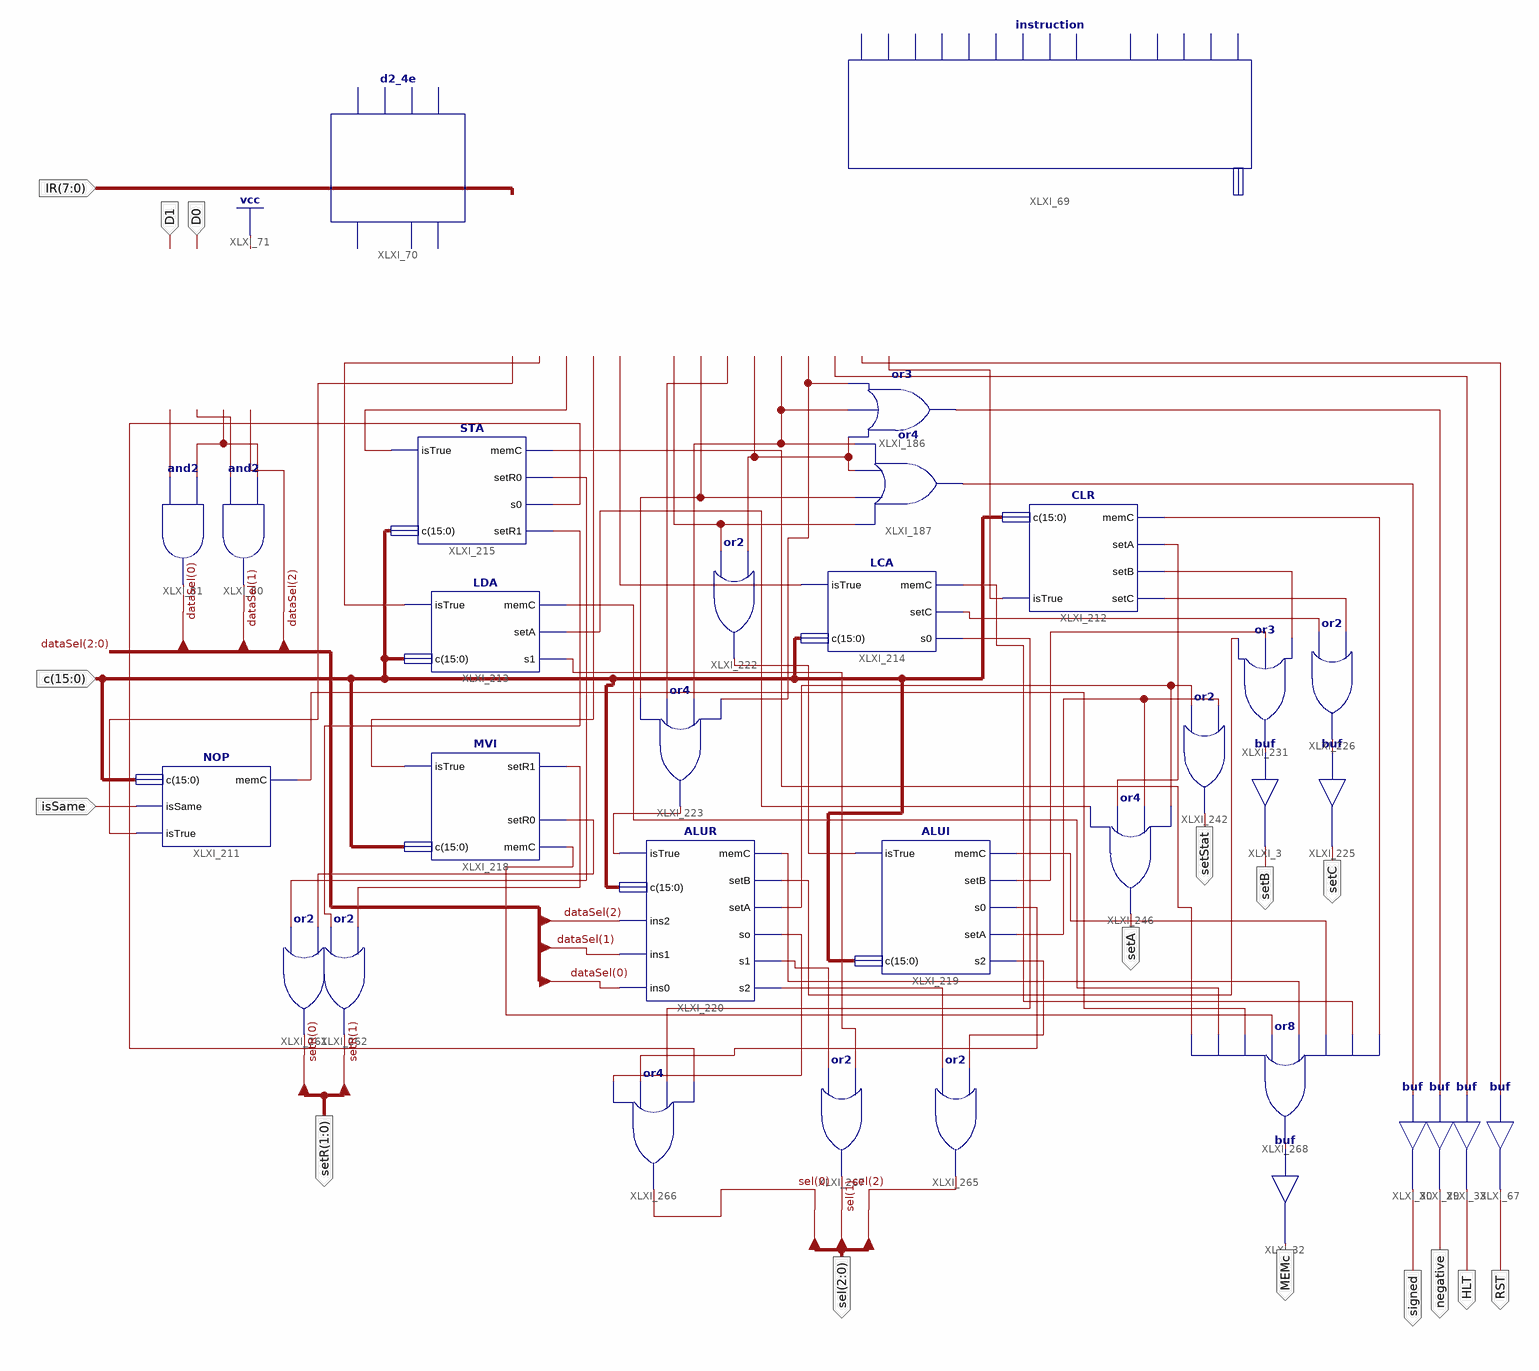
[diagram p0: schematic sheet 1]
// Xilinx ISE schematic signals.sch (spartan3e) as structural Verilog: 33 symbols, 16 ports
module signals (
  input  [7:0] IR,
  input  D0,
  input  D1,
  input  isSame,
  input  [15:0] c,
  output RST,
  output HLT,
  output negative,
  output \signed ,
  output setC,
  output setB,
  output setStat,
  output setA,
  output [2:0] sel,
  output [1:0] setR,
  output MEMc
);

  wire XLXN_142, XLXN_144, XLXN_145, XLXN_273, XLXN_274, XLXN_293, XLXN_306, XLXN_307, XLXN_314, XLXN_318,
       XLXN_340, XLXN_348, XLXN_349, XLXN_350, XLXN_351, XLXN_352, XLXN_355, XLXN_359, XLXN_360, XLXN_393,
       XLXN_395, XLXN_408, XLXN_411, XLXN_415, XLXN_420, XLXN_424, XLXN_425, XLXN_441, XLXN_445, XLXN_446,
       XLXN_460, XLXN_461, XLXN_477, XLXN_478, XLXN_479, XLXN_480, XLXN_484, XLXN_485, XLXN_486, XLXN_487,
       XLXN_488, XLXN_494, XLXN_495, XLXN_497, XLXN_498, XLXN_499, XLXN_507, XLXN_508, XLXN_509, XLXN_510,
       XLXN_511, XLXN_516, XLXN_517;
  wire [2:0] dataSel;

  instruction XLXI_69 (
    .IR(IR), .NOP(XLXN_355), .LDA(XLXN_352), .STA(XLXN_351), .MVI(XLXN_350), .LCA(XLXN_349), .ADDI(XLXN_517),
    .ADD(XLXN_314), .ADDU(XLXN_348), .SBI(XLXN_516), .SUB(XLXN_307), .SUBU(XLXN_306), .HLT(XLXN_274),
    .RST(XLXN_273), .CLR(XLXN_359));
  and XLXI_80 (dataSel[1], XLXN_144, XLXN_145);
  and XLXI_81 (dataSel[0], XLXN_142, XLXN_145);
  d2_4e XLXI_70 (.A0(D1), .A1(D0), .E(1'b1), .D0(XLXN_142), .D1(XLXN_144), .D2(XLXN_145), .D3(dataSel[2]));
  buf XLXI_67 (RST, XLXN_273);
  buf XLXI_33 (HLT, XLXN_274);
  or XLXI_186 (XLXN_318, XLXN_516, XLXN_307, XLXN_306);
  or XLXI_187 (XLXN_340, XLXN_517, XLXN_314, XLXN_516, XLXN_307);
  buf XLXI_29 (negative, XLXN_318);
  buf XLXI_30 (\signed , XLXN_340);
  NOP XLXI_211 (.c(c), .isSame(isSame), .isTrue(XLXN_355), .memC(XLXN_509));
  CLR XLXI_212 (.c(c), .isTrue(XLXN_359), .memC(XLXN_360), .setA(XLXN_460), .setB(XLXN_420), .setC(XLXN_408));
  LDA XLXI_213 (.isTrue(XLXN_352), .c(c), .memC(XLXN_510), .setA(XLXN_461), .s1(XLXN_497));
  LCA XLXI_214 (.isTrue(XLXN_349), .c(c), .memC(XLXN_498), .setC(XLXN_411), .s0(XLXN_494));
  STA XLXI_215 (.isTrue(XLXN_351), .c(c), .memC(XLXN_511), .setR0(XLXN_478), .s0(XLXN_495), .setR1(XLXN_480));
  MVI XLXI_218 (.isTrue(XLXN_350), .c(c), .setR1(XLXN_479), .setR0(XLXN_477), .memC(XLXN_508));
  ALUI XLXI_219 (
    .isTrue(XLXN_395), .c(c), .memC(XLXN_499), .setB(XLXN_424), .s0(XLXN_488), .setA(XLXN_446), .s2(XLXN_487));
  ALUR XLXI_220 (
    .isTrue(XLXN_393), .c(c), .ins2(dataSel[2]), .ins1(dataSel[1]), .ins0(dataSel[0]), .memC(XLXN_507),
    .setB(XLXN_425), .setA(XLXN_445), .so(XLXN_484), .s1(XLXN_485), .s2(XLXN_486));
  or XLXI_222 (XLXN_395, XLXN_517, XLXN_516);
  or XLXI_223 (XLXN_393, XLXN_314, XLXN_348, XLXN_307, XLXN_306);
  buf XLXI_225 (setC, XLXN_415);
  or XLXI_226 (XLXN_415, XLXN_411, XLXN_408);
  or XLXI_231 (XLXN_441, XLXN_425, XLXN_424, XLXN_420);
  buf XLXI_3 (setB, XLXN_441);
  or XLXI_242 (setStat, XLXN_445, XLXN_446);
  or XLXI_246 (setA, XLXN_461, XLXN_460, XLXN_446, XLXN_445);
  or XLXI_261 (setR[0], XLXN_478, XLXN_477);
  or XLXI_262 (setR[1], XLXN_480, XLXN_479);
  or XLXI_265 (sel[2], XLXN_486, XLXN_487);
  or XLXI_266 (sel[0], XLXN_484, XLXN_488, XLXN_494, XLXN_495);
  or XLXI_267 (sel[1], XLXN_485, XLXN_497);
  or XLXI_268 (XLXN_293, XLXN_511, XLXN_510, XLXN_509, XLXN_508, XLXN_507, XLXN_499, XLXN_498, XLXN_360);
  buf XLXI_32 (MEMc, XLXN_293);
endmodule
